# Altium schematic sheet BUTTON-LEDs .SchDoc
size A4; SheetNumber: 28; SheetTotal: 32
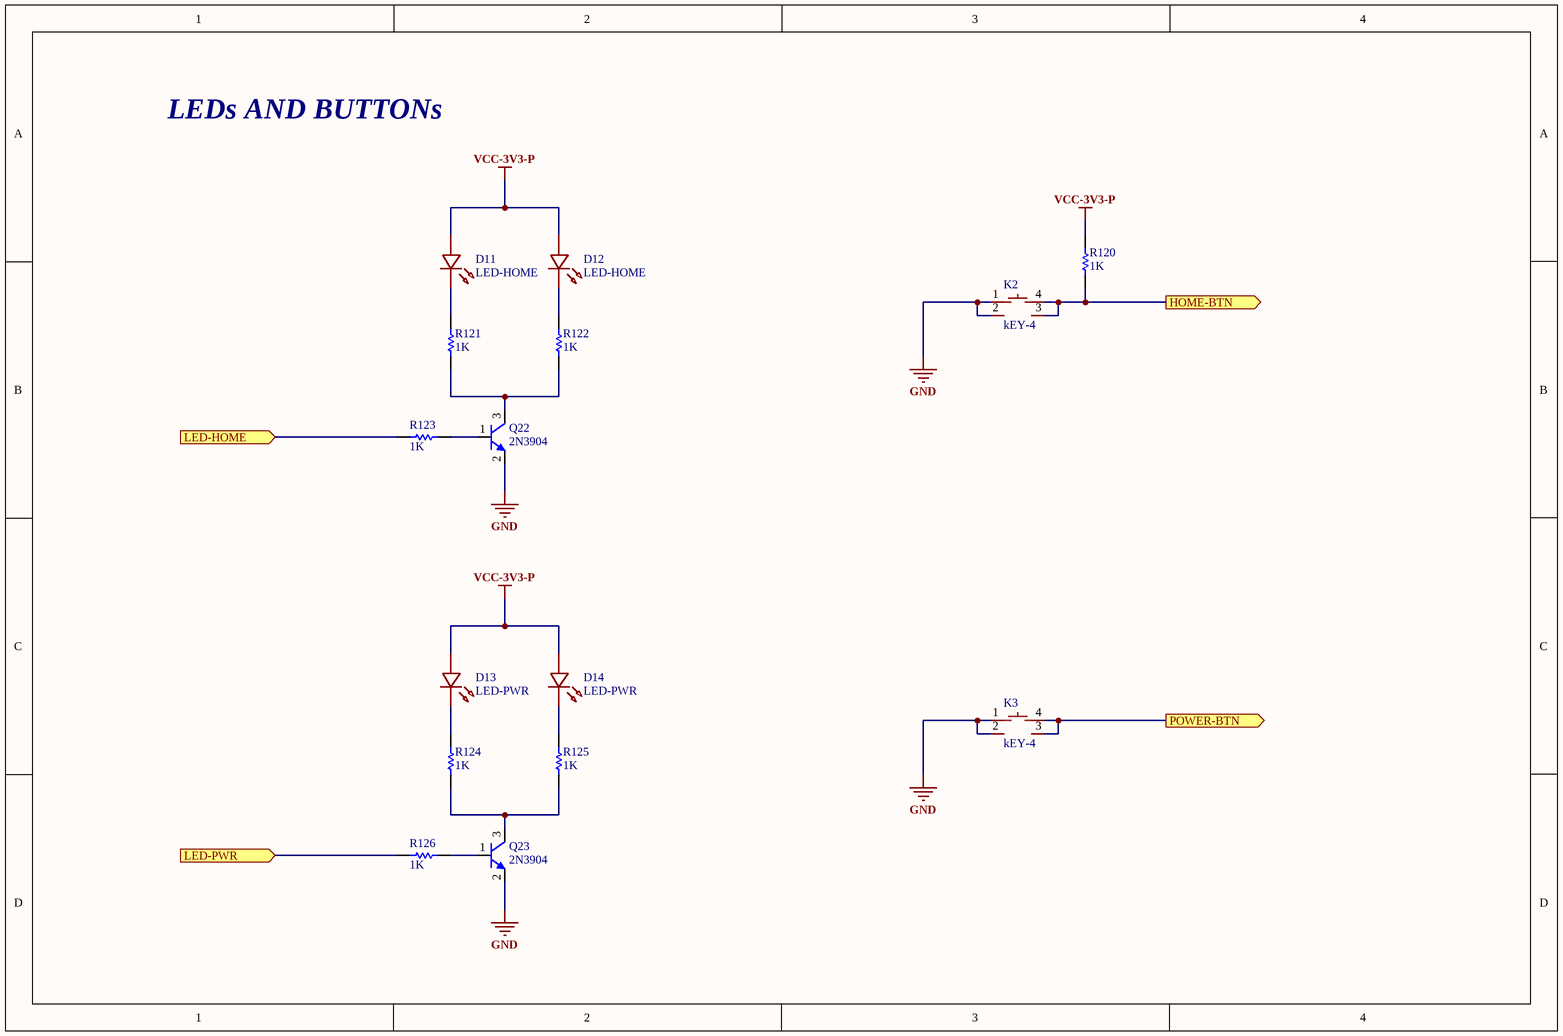
[diagram p0: BUTTON-LEDs .SchDoc]

## Parts
D11  LED-HOME  [LED0603-B]
D12  LED-HOME  [LED0603-B]
D13  LED-PWR  [LED0603-B]
D14  LED-PWR  [LED0603-B]
K2  kEY-4  [KEY-SMD_4P-L6.0-W6.0-P4.50-LS9.0]
K3  kEY-4  [KEY-SMD_4P-L6.0-W6.0-P4.50-LS9.0]
Q22  2N3904  [SOT23-3D]
Q23  2N3904  [SOT23-3D]
R120  1K  [RES-0402]
R121  1K  [RES-0402]
R122  1K  [RES-0402]
R123  1K  [RES-0402]
R124  1K  [RES-0402]
R125  1K  [RES-0402]
R126  1K  [RES-0402]

## Ports
HOME-BTN (out, see Controller-RK3562-TOP[3D]), LED-HOME (in, see Controller-RK3562-TOP[3D]), LED-PWR (in, see Controller-RK3562-TOP[3D]), POWER-BTN (out, see Controller-RK3562-TOP[3D])

## Nets
GND: K2.1 K2.2 K3.1 K3.2 Q22.2(E) Q23.2(E)
VCC-3V3-P: D11.1 D12.1 D13.1 D14.1 R120.2
HOME-BTN: K2.3 K2.4 R120.1 ; port HOME-BTN
LED-HOME: R123.2 ; port LED-HOME
LED-PWR: R126.2 ; port LED-PWR
POWER-BTN: K3.3 K3.4 ; port POWER-BTN
NetD11_2: D11.2 R121.2
NetD12_2: D12.2 R122.2
NetD13_2: D13.2 R124.2
NetD14_2: D14.2 R125.2
NetQ22_1: Q22.1(B) R123.1
NetQ22_3: Q22.3(C) R121.1 R122.1
NetQ23_1: Q23.1(B) R126.1
NetQ23_3: Q23.3(C) R124.1 R125.1

## Notes on the sheet
- LEDs AND BUTTONs

## Library data of the parts
D11-D14 = LED-SMD: ManufacturingPartNumber: *; Manufacturer: *; SupplierPartNumber: *; Supplier: *; VoltageRate: *
K2 K3 = kEY-4: ManufacturingPartNumber: TS36CA-0.6 250gf 031; Manufacturer: SHOU HAN(首韩); SupplierPartNumber: C2906288; Supplier: LCSC; VoltageRate: *
Q22 Q23 = NPN-SOT23: ManufacturingPartNumber: *; Manufacturer: *; SupplierPartNumber: *; Supplier: *; VoltageRate: *
R120-R126 = Resistor-1: ManufacturingPartNumber: *; Manufacturer: *; SupplierPartNumber: *; Supplier: *; VoltageRate: *